# Altium schematic sheet Knock Sensing.SchDoc: RB25DET - Knock Sensing
size A4; Address1: Drawn By:; Address2: Dan Visser; DocumentNumber: A; Revision: 0.1; SheetNumber: 9; SheetTotal: 14
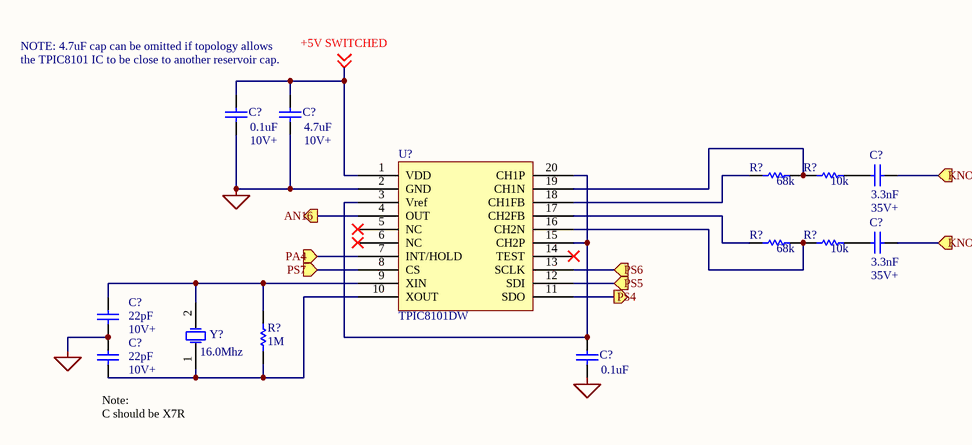
[diagram p0: Knock Sensing.SchDoc]

## Parts
(Parts that share a designator on the sheet are numbered #1, #2 ... from top to bottom, then left to right.)
C?#1  value 0.1uF  [RAD-0.3]
C?#2  value 4.7uF  [RAD-0.3]
C?#3  value 3.3nF  [RAD-0.3]
C?#4  value 3.3nF  [RAD-0.3]
C?#5  value 22pF  [RAD-0.3]
C?#6  value 22pF  [RAD-0.3]
C?#7  value 0.1uF  [RAD-0.3]
R?#1  value 68k  [AXIAL-0.3]
R?#2  value 10k  [AXIAL-0.3]
R?#3  value 68k  [AXIAL-0.3]
R?#4  value 10k  [AXIAL-0.3]
R?#5  value 1M  [AXIAL-0.3]
U?  TPIC8101DW  [SOIC20_N]
Y?  16.0Mhz  [R38]

## Ports
AN16 (out), KNOCK SENSOR 1 (in), KNOCK SENSOR 2 (in), PA4 (in), PS4 (out), PS5 (in), PS6 (in), PS7 (in)

## Nets
NetC?#1_1: C?#1.1 C?#2.1 C?#5.1 C?#6.2 C?#7.1 U?.2(GND)
+5V SWITCHED: C?#1.2 C?#2.2 U?.1(VDD) ; off-sheet +5V SWITCHED
AN16: U?.4(OUT) ; port AN16
KNOCK SENSOR 1: C?#3.2 ; port KNOCK SENSOR 1
KNOCK SENSOR 2: C?#4.2 ; port KNOCK SENSOR 2
PA4: U?.7(INT/HOLD) ; port PA4
PS4: U?.11(SDO) ; port PS4
PS5: U?.12(SDI) ; port PS5
PS6: U?.13(SCLK) ; port PS6
PS7: U?.8(CS) ; port PS7
NetC?#3_1: C?#3.1 R?#2.2
NetC?#4_1: C?#4.1 R?#4.2
NetC?#5_2: C?#5.2 R?#5.1 U?.9(XIN) Y?.2(OSC2)
NetC?#6_1: C?#6.1 R?#5.2 U?.10(XOUT) Y?.1(OSC1)
NetC?#7_2: C?#7.2 U?.3(Vref) U?.15(CH2P) U?.20(CH1P)
NetR?#1_1: R?#1.1 U?.18(CH1FB)
NetR?#1_2: R?#1.2 R?#2.1 U?.19(CH1N)
NetR?#3_1: R?#3.1 U?.17(CH2FB)
NetR?#3_2: R?#3.2 R?#4.1 U?.16(CH2N)

Not connected (* = marked no-connect by the designer): U? 5(NC)* 6(NC)* 14(TEST)*

## Notes on the sheet
- NOTE: 4.7uF cap can be omitted if topology allows
- (near C?#2) the TPIC8101 IC to be close to another reservoir cap.
- (near C?#1) 10V+
- (near C?#2) 10V+
- (near C?#3) 35V+
- 35V+
- (near C?#5) 10V+
- (near C?#6) 10V+
- Note:
  C should be X7R
- Title
- Size:
- Date:
- A4
- Number:
- Time:
- Revision:
- Sheet
- of

## Library data of the parts
C?#1-C?#7 = Cap: Capacitor; Published: 8-Jun-2000; LatestRevisionDate: 17-Jul-2002; LatestRevisionNote: Re-released for DXP Platform.; PackageReference: RAD-0.3; Publisher: Altium Limited; PackageDescription: Radial Cap, Thru-Hole; 2 Leads; 0.3 in Pin Spacing
R?#1-R?#5 = Res1: Resistor; Published: 8-Jun-2000; LatestRevisionDate: 17-Jul-2002; LatestRevisionNote: Re-released for DXP Platform.; PackageReference: AXIAL-0.3; Publisher: Altium Limited; PackageDescription: Axial Device, Thru-Hole; 2 Leads; 0.3 in Pin Spacing
Y? = XTAL: Crystal Oscillator; Published: 8-Jun-2000; LatestRevisionDate: 17-Jul-2002; LatestRevisionNote: Re-released for DXP Platform.; PackageReference: R38; Publisher: Altium Limited; PackageDescription: Crystal, Thru-Hole; 2 Leads; Body 3.1 x 8.2 mm (Dia.xH)